# EAGLE schematic board_RGB (EAGLE 9.5.1)
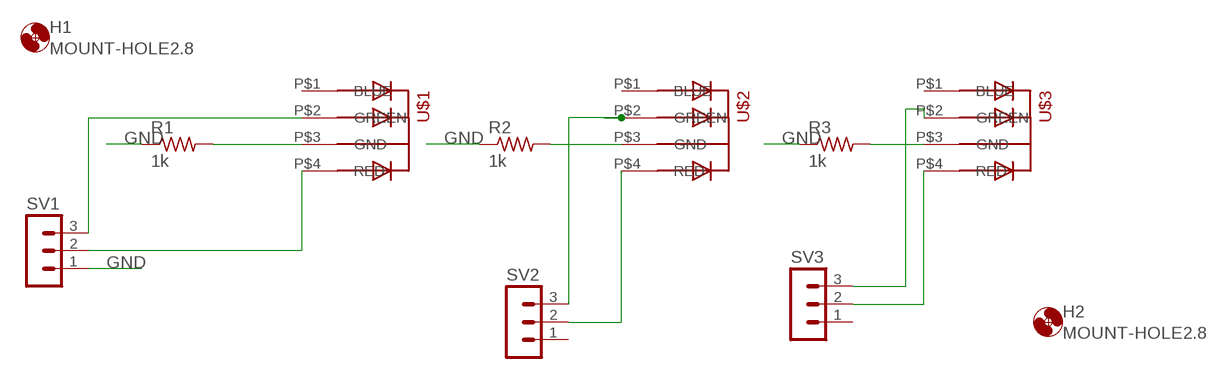
[diagram p0: schematic, sheet 1]

## Parts
H1  MOUNT-HOLE2.8  [2,8]
H2  MOUNT-HOLE2.8  [2,8]
R1  1k  R-US_0207/10  [0207/10]
R2  1k  R-US_0207/10  [0207/10]
R3  1k  R-US_0207/10  [0207/10]
SV1  MA03-1  [MA03-1]
SV2  MA03-1  [MA03-1]
SV3  MA03-1  [MA03-1]
U$1  5MMRGBLED  [LED5MMRGB]
U$2  5MMRGBLED  [LED5MMRGB]
U$3  5MMRGBLED  [LED5MMRGB]

## Nets
GND: R1.1 R2.1 R3.1 SV1.1
N$1: SV2.2 U$2.P$4(RED)
N$2: R1.2 U$1.P$3(GND)
N$3: SV1.3 U$1.P$2(GREEN)
N$6: SV3.2 U$3.P$4(RED)
N$7: SV3.3 U$3.P$2(GREEN)
N$8: R3.2 U$3.P$3(GND)
N$9: R2.2 U$2.P$3(GND)
N$10: SV1.2 U$1.P$4(RED)
N$11: SV2.3 U$2.P$2(GREEN)
Unconnected: SV2.1 SV3.1 U$1.P$1(BLUE) U$2.P$1(BLUE) U$3.P$1(BLUE)

## Library data of the parts
H1 H2 = holes:MOUNT-HOLE: MOUNTING HOLE with drill center marker
R1-R3 = rcl:R-US_: RESISTOR, American symbol; SPICEPREFIX: R
SV1-SV3 = con-lstb:MA03-1: PIN HEADER; OC_FARNELL: unknown; OC_NEWARK: unknown
U$1-U$3 = led_rgb:5MMRGBLED